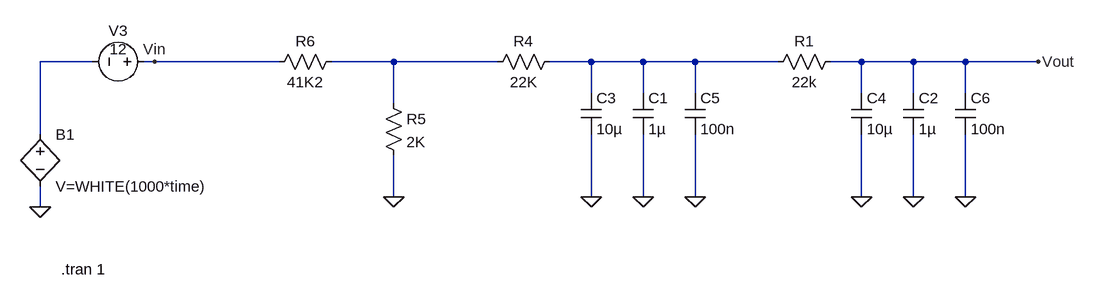
[diagram p0: schematic OA_Filter.asc]
OA_Filter.asc, the LTspice schematic file:
Version 4.1
SHEET 1 1640 928
WIRE -1392 192 -1472 192
WIRE -1296 192 -1312 192
WIRE -1104 192 -1296 192
WIRE -928 192 -1024 192
WIRE -768 192 -928 192
WIRE -624 192 -688 192
WIRE -544 192 -624 192
WIRE -464 192 -544 192
WIRE -336 192 -464 192
WIRE -208 192 -256 192
WIRE -128 192 -208 192
WIRE -48 192 -128 192
WIRE 64 192 -48 192
WIRE -624 240 -624 192
WIRE -544 240 -544 192
WIRE -464 240 -464 192
WIRE -208 240 -208 192
WIRE -128 240 -128 192
WIRE -48 240 -48 192
WIRE -928 256 -928 192
WIRE -1472 304 -1472 192
WIRE -928 400 -928 336
WIRE -624 400 -624 304
WIRE -544 400 -544 304
WIRE -464 400 -464 304
WIRE -208 400 -208 304
WIRE -128 400 -128 304
WIRE -48 400 -48 304
WIRE -1472 416 -1472 384
FLAG -1472 416 0
FLAG -624 400 0
FLAG -1296 192 Vin
FLAG -544 400 0
FLAG -208 400 0
FLAG -128 400 0
FLAG 64 192 Vout
FLAG -928 400 0
FLAG -464 400 0
FLAG -48 400 0
SYMBOL bv -1472 288 R0
SYMATTR InstName B1
SYMATTR Value V=WHITE(1000*time)
SYMBOL voltage -1296 192 R90
WINDOW 0 -32 56 VBottom 2
WINDOW 3 -4 56 VBottom 2
WINDOW 123 0 0 Left 0
WINDOW 39 0 0 Left 0
SYMATTR InstName V3
SYMATTR Value 12
SYMBOL res -672 176 R90
WINDOW 0 0 56 VBottom 2
WINDOW 3 32 56 VTop 2
SYMATTR InstName R4
SYMATTR Value 22K
SYMBOL cap -640 240 R0
SYMATTR InstName C3
SYMATTR Value 10µ
SYMATTR SpiceLine V=25
SYMBOL cap -560 240 R0
SYMATTR InstName C1
SYMATTR Value 1µ
SYMBOL cap -144 240 R0
SYMATTR InstName C2
SYMATTR Value 1µ
SYMBOL cap -224 240 R0
SYMATTR InstName C4
SYMATTR Value 10µ
SYMBOL res -240 176 R90
WINDOW 0 0 56 VBottom 2
WINDOW 3 32 56 VTop 2
SYMATTR InstName R1
SYMATTR Value 22k
SYMBOL res -944 240 R0
SYMATTR InstName R5
SYMATTR Value 2K
SYMBOL res -1008 176 R90
WINDOW 0 0 56 VBottom 2
WINDOW 3 32 56 VTop 2
SYMATTR InstName R6
SYMATTR Value 41K2
SYMBOL cap -480 240 R0
SYMATTR InstName C5
SYMATTR Value 100n
SYMBOL cap -64 240 R0
SYMATTR InstName C6
SYMATTR Value 100n
TEXT -1440 512 Left 2 !.tran 1

The netlist it stands for:
* OA_Filter.asc
B1 N001 0 V=WHITE(1000*time)
V3 Vin N001 12
R4 N003 N002 22K
C3 N003 0 10µ V=25
C1 N003 0 1µ
C2 Vout 0 1µ
C4 Vout 0 10µ
R1 Vout N003 22k
R5 N002 0 2K
R6 N002 Vin 41K2
C5 N003 0 100n
C6 Vout 0 100n
.tran 1
.backanno
.end